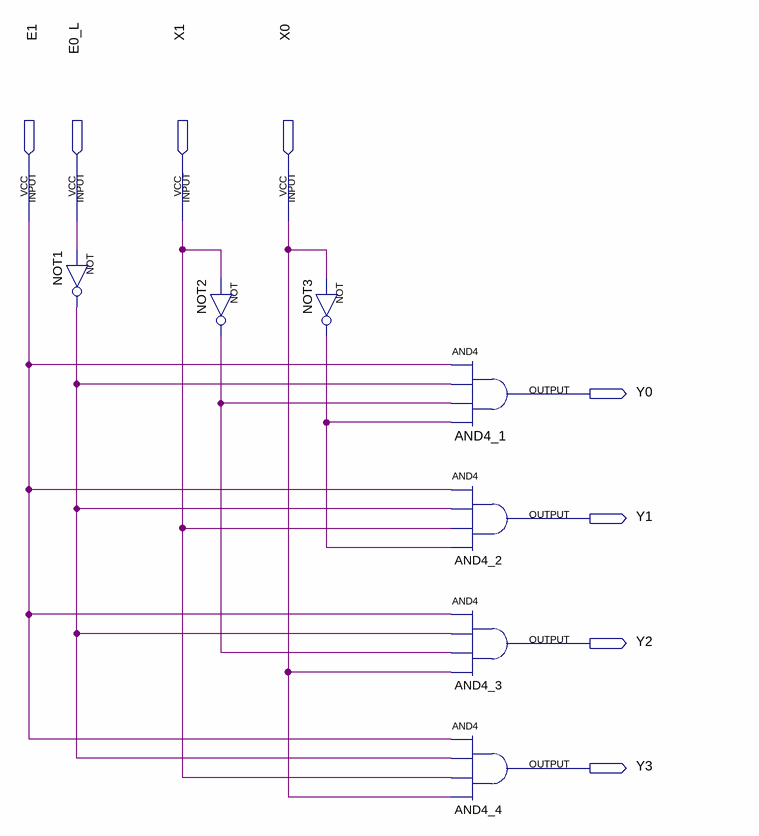
[diagram p0: schematic sheet]
// Quartus schematic Dec2_4.bdf as structural Verilog: 7 symbols, 8 pins
module Dec2_4 (
  input  E1,
  input  E0_L,
  input  X1,
  input  X0,
  output Y0,
  output Y1,
  output Y2,
  output Y3
);

  wire NOT1_out, NOT2_out, NOT3_out;

  not NOT1 (NOT1_out, E0_L);
  not NOT2 (NOT2_out, X1);
  not NOT3 (NOT3_out, X0);
  and AND4_1 (Y0, E1, NOT1_out, NOT2_out, NOT3_out);
  and AND4_2 (Y1, E1, NOT1_out, X1, NOT3_out);
  and AND4_3 (Y2, E1, NOT1_out, NOT2_out, X0);
  and AND4_4 (Y3, E1, NOT1_out, X1, X0);
endmodule
